# Altium schematic sheet adc_signal.SchDoc
size A4; Author: Omri Nissan; Organization: Altium Limited; Address1: -; Address2: San Luis Obispo; Address3: California, 93401; Address4: United States; DocumentNumber: 9; SheetNumber: 9; SheetTotal: 10
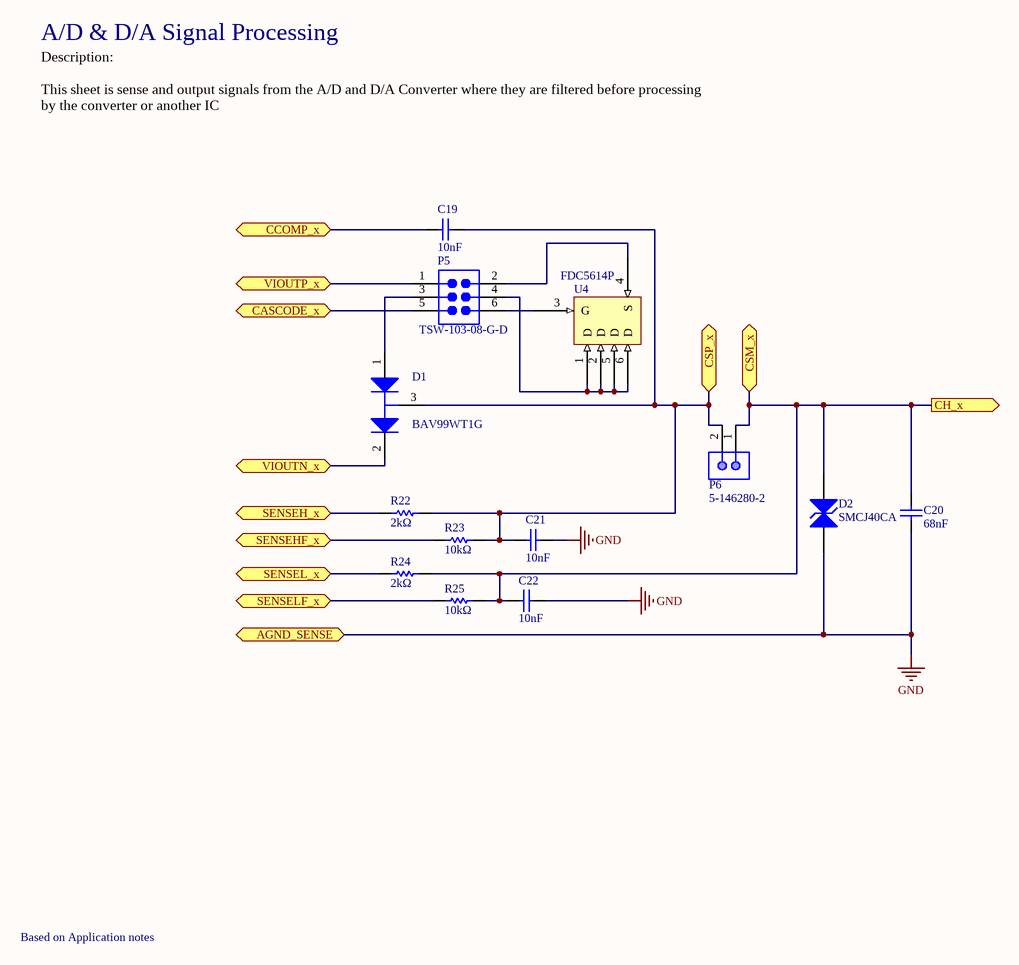
[diagram p0: adc_signal.SchDoc]

## Parts
C19  10nF  [CAPC1608X90X35ML10T15]
C20  68nF  [CAPC1608X90X35LL10T15]
C21  10nF  [CAPC1608X90X35ML10T15]
C22  10nF  [CAPC1608X90X35ML10T15]
D1  BAV99WT1G  [ONSC-SOT-323-3-419-04_V]
D2  SMCJ40CA  [FAIR-DO-214AB-A-2_V]
P5  TSW-103-08-G-D  [SMTC-TSW-103-08-X-D]
P6  5-146280-2  [TECO-5-146280-2_V]
R22  2kΩ  [RESC1608X55X30NL20T20]
R23  10kΩ  [RESC1608X55X25ML10T15]
R24  2kΩ  [RESC1608X55X30NL20T20]
R25  10kΩ  [RESC1608X55X25ML10T15]
U4  FDC5614P  [ONSC-CPH-6_V]

## Ports
AGND_SENSE (bidir), CASCODE_x (bidir), CCOMP_x (bidir), CH_x (out), CSM_x (bidir), CSP_x (bidir), SENSEH_x (bidir), SENSEHF_x (bidir), SENSEL_x (bidir), SENSELF_x (bidir), VIOUTN_x (bidir), VIOUTP_x (bidir)

## Nets
GND: C20.1 C21.1 C22.1 D2.1(A) ; port AGND_SENSE
CASCODE_x: P5.5 ; port CASCODE_x
CCOMP_x: C19.1 ; port CCOMP_x
CH_x: C20.2 C22.2 D2.2(A) P6.1 R24.2 R25.2 ; port CSM_x, port CH_x
CSP_x: C19.2 C21.2 D1.3(K/A) P6.2 R22.2 R23.2 ; port CSP_x
SENSEH_x: R22.1 ; port SENSEH_x
SENSEHF_x: R23.1 ; port SENSEHF_x
SENSEL_x: R24.1 ; port SENSEL_x
SENSELF_x: R25.1 ; port SENSELF_x
VIOUTN_x: D1.2(K) ; port VIOUTN_x
VIOUTP_x: P5.1 ; port VIOUTP_x
NetD1_1: D1.1(A) P5.3
NetP5_2: P5.2 U4.4(S)
NetP5_4: P5.4 U4.1(D) U4.2(D) U4.5(D) U4.6(D)
NetP5_6: P5.6 U4.3(G)

## Notes on the sheet
- A/D & D/A Signal Processing
- Description:
  This sheet is sense and output signals from the A/D and D/A Converter where they are filtered before processing by the converter or another IC
- Based on Application notes
- Title
- Size:
- Date:
- A4
- Number:
- Time:
- Revision:
- Sheet
- of
- File:

## Library data of the parts
C19 C21 C22 = CMP-2100-03642-1: GRM188R71H103KA01D - Chip Capacitor, 10 nF, +/- 10%, 50 V, -55 to 125 degC, 0603 (1608 Metric), RoHS, Tape and Reel; Manufacturer: Murata; Insulation Resistance: 10GR; Dielectric: X7R; Voltage Rating: 50V; Material: Ceramic; Package Quantity: 1; Lead Free: LeadFree; Case/Package: 0603; Termination: SMD/SMT; REACH SVHC: Unknown; Manufacturer URL: http://www.murata.com/; Datasheet URL: http://search.murata.co.jp/Ceramy/image/img/A01X/G101/ENG/GRM188R71H103KA01-01.pdf; Mount: SurfaceMount; Datasheet Version: 42401.0; Number of Pins: 2; Length: 1.6mm; Voltage: 50V; Depth: 0.8mm; Tolerance: 10%; Min Operating Temperature: -55degC; Voltage Rating (DC): 50V; Max Operating Temperature: 125degC; Package Description: 2-Pin Surface Mount Device, Body 1.6 x 0.8 mm; RoHSCompliant: True; Case Code (Imperial): 0603; Width: 0.031inch; Case Code (Metric): 1608; Height: 0.8mm; Package Reference: 0603; Packaging: TapeandReel; Thickness: 0.035inch; Capacitance: 10nF; Dielectric Material: Ceramic
C20 = CMP-2006-02937-1: GRM188R71H683KA93D; Manufacturer: Murata; Part Number: GRM188R71H683KA93D
D1 = CMP-1054-00187-1: Dual Series Switching Diodes, 3-Pin SOT-323, Pb-Free, Tape and Reel; Manufacturer: On Semiconductor; trr Max (ns): 6; IF Max (A): 0.215; Configuration: Dual Series; ComponentLink1Description: Manufacturer URL; ComponentLink1URL: http://www.onsemi.com/; ComponentLink2Description: Datasheet; PackageDescription: 3-Pin Small Outline Transistor, Body 2 x 1.25 mm, Pitch 0.65 mm; PackageReference: SOT-323-3-419-04; ComponentLink3URL: http://www.onsemi.com/pub_link/Collateral/419-04.PDF; Packing: Tape and Reel; ComponentLink3Description: Package Specification; DatasheetVersion: Rev. 7; RoHS: TRUE; ComponentLink2URL: http://www.onsemi.cn/pub_link/Collateral/BAV99WT1-D.PDF; Mounting Technology: Surface Mount; PartNumber: BAV99WT1G; PackageVersion: Rev. N, 11/2008
D2 = CMP-2000-07110-1: Transient Voltage Suppressor, 1500 W, 40 V, 2-Pin SMD, RoHS, Tape and Reel; Manufacturer: Fairchild Semiconductor; Type: TRANSVOLTAGESUPPRESSORDIODE; Breakdown Voltage-Max (V): 49.1; Number of Elements: 1; Breakdown Voltage-Min (V): 44.4; Non-rep Peak Rev Power Dis-Max (W): 1500; Additional Feature: ULRECOGNIZED; Diode Element Material: SILICON; Configuration: SINGLE; Package Body Material: PLASTIC/EPOXY; Polarity: BIDIRECTIONAL; JEDEC-95 Code: DO-214AB; CAGE Code: 1HBD3,07933,59621,7D893; Number of Terminals: 2; Package Description: 2-Pin Surface Mount Device, Body 6.875 x 5.9 mm; Terminal Position: DUAL; Terminal Finish: MATTETIN; Package Style: SMALLOUTLINE; Datasheet Version: Rev. 5.7, 09/2015; Datasheet URL: https://www.fairchildsemi.com/datasheets/SM/SMCJ40CA.pdf; Technology: AVALANCHE; Peak Reflow Temperature (Cel): 260; Manufacturer URL: https://www.fairchildsemi.com/; RoHS Compliant: YES; JESD-30 Code: R-PDSO-C2; Moisture Sensitivity Level: 1; Package Shape: RECTANGULAR; Terminal Form: CBEND; Mounting Technology: SurfaceMount; Lead Free: YES; Package Reference: DO-214AB; Surface Mount: YES; JESD-97 Code: e3
P5 = CMP-1024-00338-1: 0.025" SQ Post Header, Through-hole, Vertical, -55 to 125 degC, 2.54 mm Pitch, 6-Pin, Male, RoHS; Manufacturer: Samtec; Pitch: 2.54 mm; ComponentLink1URL: http://www.samtec.com; ComponentLink2URL: http://www.samtec.com/documents/webfiles/pdf/TSW_TH.PDF; Temperature Range: -55 to 125 degC; RoHS: True; ComponentLink2Description: Datasheet; PackageReference: TSW-103-08-X-D; ComponentLink3Description: Package Specification; PackageDescription: .025[0.64] SQ. Post Terminal Strip Assembly; DatasheetVersion: F-214; Mounting Technology: Through-hole; ComponentLink1Description: Manufacturer URL; Orientation: Vertical; PartNumber: TSW-103-08-G-D; PackageVersion: DM, 8/1988; ComponentLink3URL: http://www.samtec.com/documents/webfiles/cpdf/TSW-XXX-XX-XXX-X-XX-XXX-MKT.pdf
P6 = CMP-2000-07492-1: Male Header, Pitch 2.54 mm, 1 x 2 Position, Height 8.21 mm, Tail Length 3.05 mm, -65 to 105 degC, RoHS, Bulk; Manufacturer: TE Connectivity; Mating Connector Lock: No(Without); Number of Positions: 2; Pitch: 2.54mm; PCB Mounting Orientation: Vertical; Keyed: No; Case\/Package: 100; Mating Post Length: 0.23inch; High Temperature Housing: Yes; Max Current Rating: 5A; PCB Thickness: 0.063inch; PCB Mount Retention: Without; Approvals: CSA; Current Rating: 3A; Radiation Hardening: No; Length: 4.67mm; Contact Mating Length: 0.23inch; Connector Type: Header; Number of Rows: 1; Termination Post Length: 0.12inch; Board Standoff: No(Without); Max Operating Temperature: 105degC; Contact Shape: Square; Selectively Loaded: No(Without); Gasket: No(Without); Number of Contacts: 2; Contact Gender: Male; Mating Alignment: No(Without); Manufacturer URL: http://www.te.com/; Datasheet URL: http://www.te.com/commerce/DocumentDelivery/DDEController?Action=showdoc&DocId=Customer+Drawing%7F146280%7FH1%7Fpdf%7FEnglish%7FENG_CD_146280_H1.pdf%7F5-146280-2; Mount: ThroughHole; Orientation: Straight; Packaging: Carton; Package Reference: 5-146280-2; Package Quantity: 500; Stabilizers: No(Without); Row Spacing: 2.54mm; Contact Material: CopperAlloy; Panel Mount Retention: No(Without); Datasheet Version: Rev. H1, 08/2016; Housing Colour: Black; Colour: Black; Package Description: Male Header, Pitch 2.54 mm, 1 x 2 Position, Height 8.21 mm, Tail Length 3.05 mm; Contact Plating: Matte; Housing Material: Polymer; Contact Protection: No(Without); Min Operating Temperature: -65degC; Mounting Technology: ThroughHole; Flammability Rating: UL94V-0; RoHSCompliant: true; Termination: ThroughHole; Depth: 2.34mm; High Speed Serial Data Connector: No
R22 R24 = CMP-2000-00945-1: ERA3AEB202V; Manufacturer: Panasonic; Part Number: ERA3AEB202V
R23 R25 = CMP-2100-03664-1: RC0603FR-0710KL - Chip Resistor, 10 KOhm, +/- 1%, 01 W, -55 to 155 degC, 0603 (1608 Metric), RoHS, Tape and Reel; Manufacturer: Yageo; Temperature Coefficient: 100ppm/degreesC; Resistance: 10KOhm; Voltage Rating: 75V; Power Rating: 100mW; Voltage Rating (DC): 50V; Composition: ThickFilm; RoHSCompliant: true; Height: 0.45mm; Lead Free: LeadFree; Case Code (Metric): 1608; Case/Package: 0603; Datasheet Version: Rev. 5, 10/2016; Package Reference: 0603; Depth: 0.8mm; Package Description: 2-Pin Surface Mount Device, Body 1.6 x 0.8 mm; Case Code (Imperial): 0603; Packaging: TapeandReel; Termination: SMD/SMT; Lead Pitch: 0.3mm; Width: 0.8mm; Number of Pins: 2; Length: 1.6mm; REACH SVHC: NoSVHC; Military Standard: Not; Max Operating Temperature: 155degC; Min Operating Temperature: -55degC; Manufacturer URL: http://www.yageo.com/; Datasheet URL: http://www.yageo.com/NewPortal/yageodocoutput?fileName=/pdf/R-Chip/PYu-RC_Group_51_RoHS_L_5.pdf; Weight: 7.1E-05oz; Tolerance: 1%
U4 = FDC5614P: MOSFET P-CH 60V 3A SSOT-6; Manufacturer 1: ON Semiconductor / Fairchild; Rds On Max: 105mR; Input Capacitance: 759pF; Rise Time: 10ns; Max Power Dissipation: 1.6W; Turn-Off Delay Time: 19ns; Element Configuration: Single; Drain to Source Breakdown Voltage: -60V; Gate to Source Voltage (Vgs): 20V; Number of Elements: 1; Turn-On Delay Time: 7ns; Nominal Vgs: -1.6V; Current Rating: -3A; Current: 2A; Supplier 1: Digi-Key; Manufacturer Part Number 1: FDC5614P; Stock 1: 81040; Pricing 1: 1=0.60000, 10=0.51300, 100=0.38330, 500=0.30116, 1000=0.23271 (USD); RoHS: Yes; Mount: Surface Mount; Case/Package: SOT-23-6; Number of Pins: 6; Contact Plating: Tin,Matte; Min Operating Temperature: -55°C; Max Operating Temperature: 150°C; Packaging: Tape and Reel; Package Quantity: 1; Drain to Source Voltage (Vdss): 60V; Continuous Drain Current (ID): 3A; Fall Time: 10ns; Drain to Source Resistance: 105mR; Power Dissipation: 1.6W; Voltage Rating (DC): -60V; On-State Resistance: 105MR; Threshold Voltage: -1.6V; Voltage: 60V; Length: 3mm; Height: 1mm; Width: 1.7mm; Radiation Hardening: No; Lead Free: Lead Free; REACH SVHC: No SVHC; ComponentLink1URL: https://datasheet.ciiva.com/932/fdc5614p-932400.pdf?src-supplier=Digi-Key; ComponentLink1Description: https://datasheet.ciiva.com/932/fdc5614p-932400.pdf?src-supplier=Digi-Key; ComponentLink2URL: https://datasheet.ciiva.com/22655/11835-22655267.pdf?src-supplier=Element14; ComponentLink2Description: https://datasheet.ciiva.com/22655/11835-22655267.pdf?src-supplier=Element14; ComponentLink3URL: https://datasheet.ciiva.com/34302/1222393-34302115.pdf?src-supplier=Jameco; ComponentLink3Description: https://datasheet.ciiva.com/34302/1222393-34302115.pdf?src-supplier=Jameco; ComponentLink4URL: https://datasheet.ciiva.com/932/fdc5614p-932401.pdf?src-supplier=Digi-Key; ComponentLink4Description: https://datasheet.ciiva.com/932/fdc5614p-932401.pdf?src-supplier=Digi-Key; ComponentLink5URL: https://datasheet.ciiva.com/6172/fdc5614p-6172565.pdf?src-supplier=Farnell; ComponentLink5Description: https://datasheet.ciiva.com/6172/fdc5614p-6172565.pdf?src-supplier=Farnell; ComponentLink6URL: https://datasheet.ciiva.com/16741/fdc5614p-16741301.pdf?src-supplier=Future+Electronics; ComponentLink6Description: https://datasheet.ciiva.com/16741/fdc5614p-16741301.pdf?src-supplier=Future+Electronics; ComponentLink7URL: https://datasheet.ciiva.com/26144/fdc5614p-26144149.pdf?src-supplier=Avnet+Europe; ComponentLink7Description: https://datasheet.ciiva.com/26144/fdc5614p-26144149.pdf?src-supplier=Avnet+Europe; ComponentLink8URL: https://datasheet.ciiva.com/22681/11835-22681846.pdf?src-supplier=Element14; ComponentLink8Description: https://datasheet.ciiva.com/22681/11835-22681846.pdf?src-supplier=Element14; ComponentLink9URL: https://datasheet.ciiva.com/8115/fdc5614p-8115420.pdf?src-supplier=Avnet; ComponentLink9Description: https://datasheet.ciiva.com/8115/fdc5614p-8115420.pdf?src-supplier=Avnet; ComponentLink10URL: https://datasheet.ciiva.com/932/fdc5614p-932399.pdf?src-supplier=Digi-Key; ComponentLink10Description: https://datasheet.ciiva.com/932/fdc5614p-932399.pdf?src-supplier=Digi-Key; ComponentLink11URL: https://datasheet.ciiva.com/7967/fdc5614p-7967823.pdf?src-supplier=Element14; ComponentLink11Description: https://datasheet.ciiva.com/7967/fdc5614p-7967823.pdf?src-supplier=Element14; Supplier Part Number 1: FDC5614PCT-ND